# EasyEDA Pro project LEDpaideng.eprj

# Schematic Schematic1
Create Date: 2022-06-27; Project Name: LEDpaideng; Schematic Name: Schematic1; Update Date: 2022-06-27
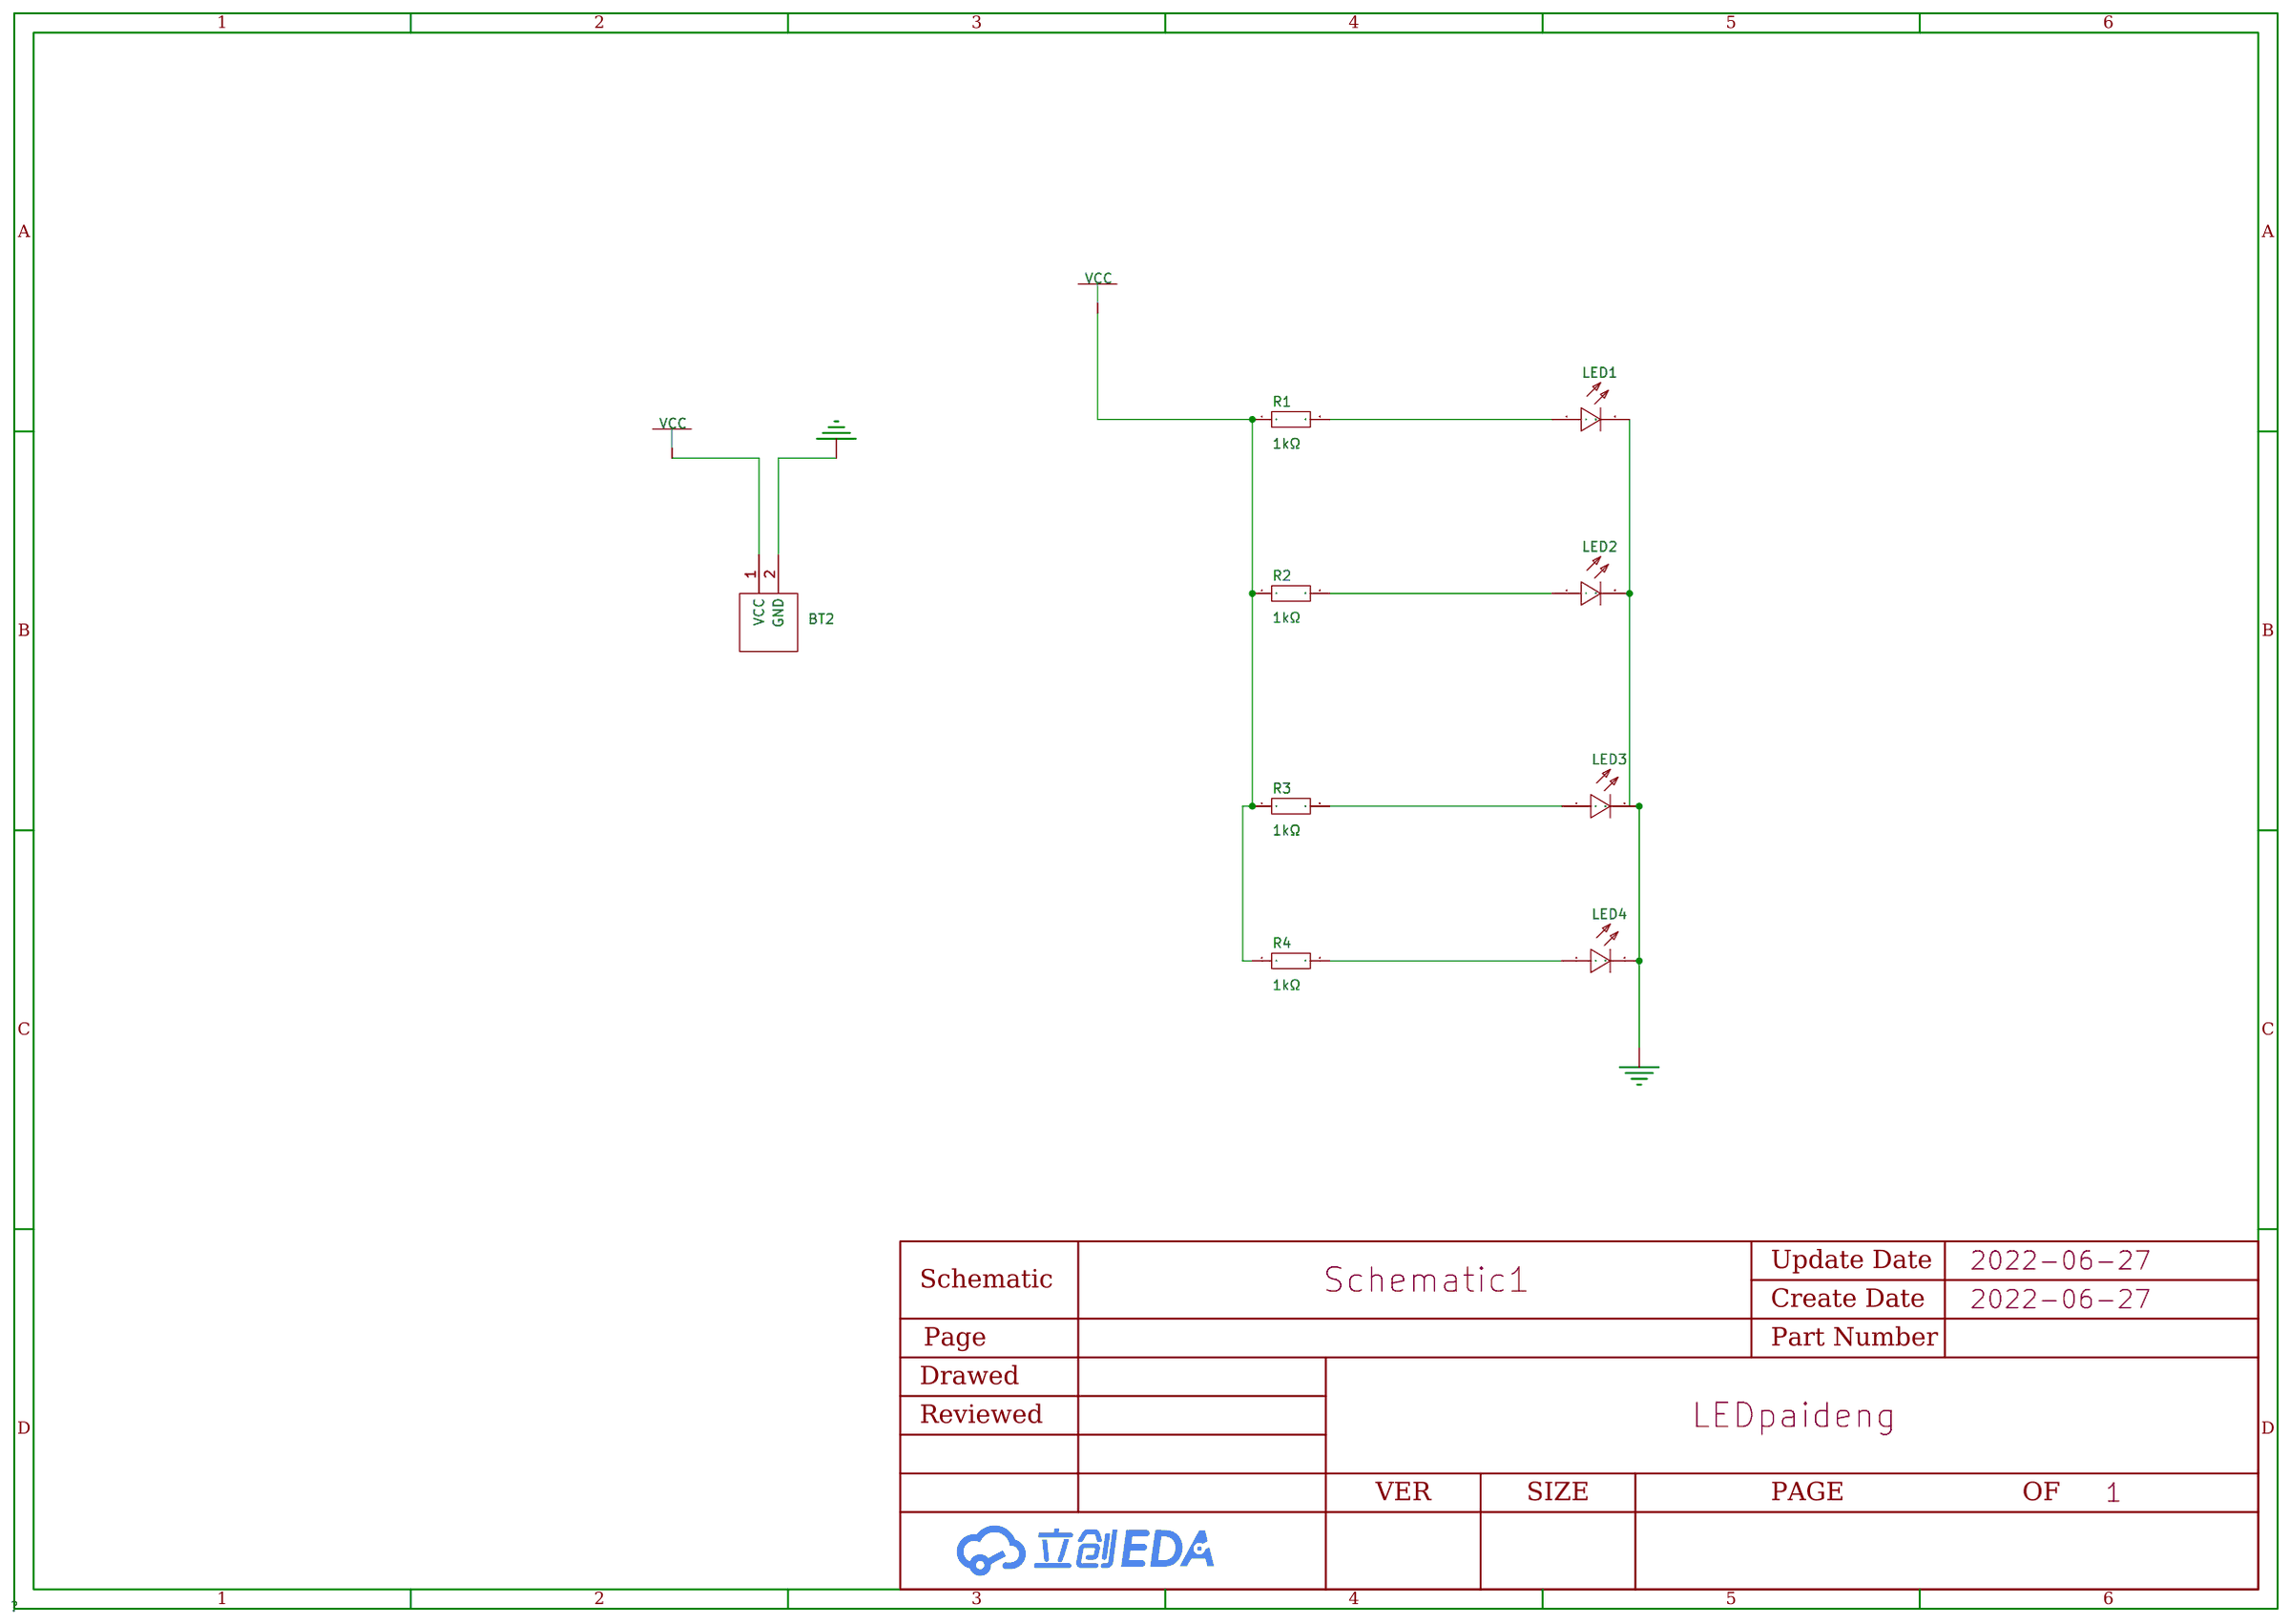
[diagram p0: schematic sheet]

## Parts
BT2  -  [C0402_NEW]
LED1  -  [LED0603-R-RD]
LED2  -  [LED0603-R-RD]
LED3  -  [LED0603-R-RD]
LED4  -  [LED0603-R-RD]
R1  1kΩ  [R0201]
R2  1kΩ  [R0201]
R3  1kΩ  [R0201]
R4  1kΩ  [R0201]

## Library data of the parts
BT2 = 五号2节并列电池盒: 连接器类型:电池盒;适用电池规格:5号;工作温度范围:-;; LCSC Part Name: 电池盒 适用电池:5号 2节并列 线长150mm; Supplier Part: C5404; Manufacturer: 国产; Datasheet: https://atta.szlcsc.com/upload/public/pdf/source/20120922/1457706536101.pdf; Supplier: LCSC; Connector Type: 电池盒; Battery Type: 5号
LED1-LED4 = 19-217/GHC-YR1S2/3T: 发光颜色:翠绿;二极管配置:-;透镜颜色:无色透明;主波长:520nm~535nm;峰值波长:518nm;色温:-;光通量(25时):-;测试电流:20mA;正向电压(VF):3.3V;发光强度:285mcd;功率:110mW;发光角度:120°;安装方式:-;工作温度:-40~+85;; LCSC Part Name: 翠绿LED; Supplier Part: C72043; Manufacturer: EVERLIGHT(台湾亿光); Supplier Footprint: 0603; JLCPCB Part Class: Basic Part; Datasheet: https://atta.szlcsc.com/upload/public/pdf/source/20160507/1462613613780.pdf; Supplier: LCSC; Emitted Color: 翠绿; Lens Color: 无色透明; Dominant Wavelength: 520nm~535nm; Peak Wavelength: 518nm; Forward Current: 20mA; Forward Voltage (VF): 3.3V; Luminous Intensity: 285mcd; Power Dissipation: 110mW; Viewing Angle: 120°; Operating Temperature: -40~+85
R1-R4 = RC-01W1002FT: 阻值:10kΩ;精度:±1%;功率:50mW;温度系数:±200ppm/;最大工作电压:25V;工作温度范围:-55~+125;; LCSC Part Name: 10kΩ ±1%; Supplier Part: C304501; Manufacturer: FH(风华); Supplier Footprint: 0201; JLCPCB Part Class: Extended Part; Datasheet: https://atta.szlcsc.com/upload/public/pdf/source/20181030/C304501_FF38550671994E5E8FB5233A4E4A9820.pdf; Supplier: LCSC; Tolerance: ±1%; Power(Watts): 50mW; Temperature Coefficient: ±200ppm/; Overload Voltage (Max): 25V; Operating Temperature Range: -55~+125

## Nets
GND: BT2.2(GND) LED1.2(C) LED2.2(C) LED3.2(C) LED4.2(C)
VCC: BT2.1(VCC) R1.1 R2.1 R3.1 R4.1
$1N1060: LED3.1(A) R3.2
$1N1066: LED4.1(A) R4.2
$1N1072: LED1.1(A) R1.2
$1N1078: LED2.1(A) R2.2

# Board PCB1
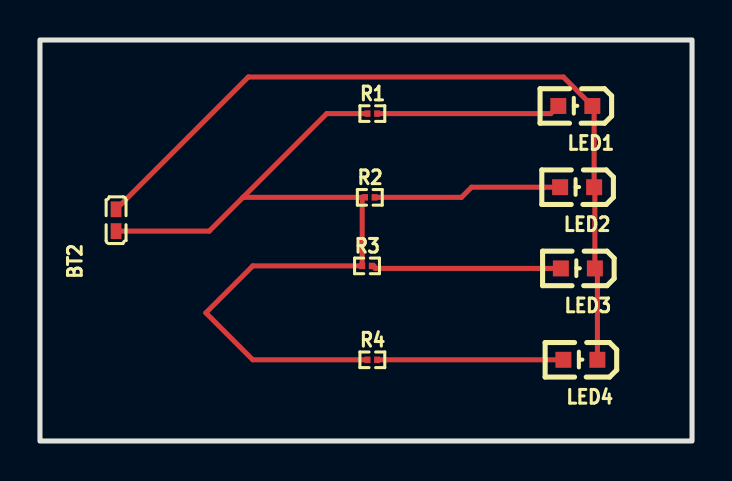
[diagram p1: board, top side]
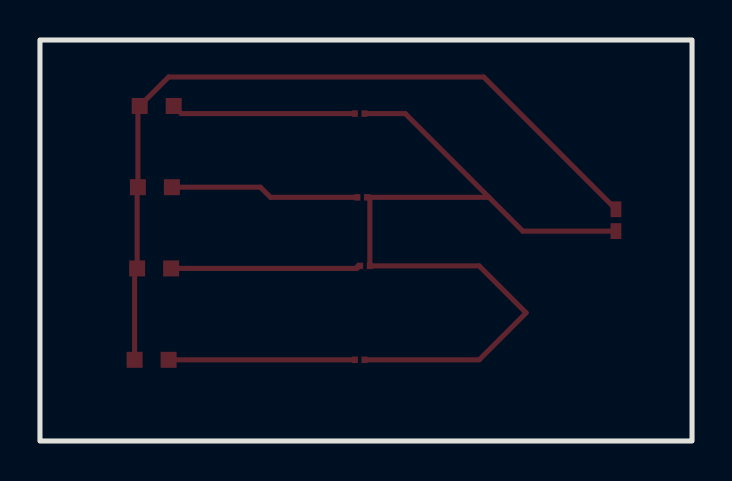
[diagram p2: board, bottom side, seen from below]

Outline 32.64 x 20.07 mm; copper layers: Top Layer, Bottom Layer. Coordinates in mm from the lower left corner of the outline.
Outline path: rectangle 0,20.07 32.64,0
Stack: Top Layer 0.035mm / Dielectric1 1.51mm FR4 er 4.5 / Bottom Layer 0.035mm

## Design rules (mm)
spacing safeClearance (default): track to track 0.152, other pairs 0.152 to 0.3
track width trackWidth (default): min 0.127, default 0.254, max 2.54
differential pair differentialPair (default): width min 0.127, default 0.254, max 2.54; gap min 0.152, default 0.152
via viaSize (default): diameter min 0.5, default 0.61, max 10; hole min 0.3, default 0.305, max 6

## Placement (name value [footprint] x y rotation side)
BT2  -  [C0402_NEW]  3.81 11.05 90 top
LED1  -  [LED0603-R-RD]  26.8 16.76 180 top
LED2  -  [LED0603-R-RD]  26.89 12.7 180 top
LED3  -  [LED0603-R-RD]  26.92 8.64 180 top
LED4  -  [LED0603-R-RD]  27.05 4.06 180 top
R1  1kΩ  [R0201]  16.64 16.38 0 top
R2  1kΩ  [R0201]  16.51 12.19 0 top
R3  1kΩ  [R0201]  16.37 8.76 0 top
R4  1kΩ  [R0201]  16.64 4.06 0 top

## Footprints (pads in the part's own frame, mm; a bottom-side part is the same pattern mirrored in y, then rotated)
C0402_NEW
  rect 0.79x0.541 smd: 1(-0.546,0) 2(0.546,0)
LED0603-R-RD
  rect 0.8x0.8 smd: 1(0.851,0) 2(-0.851,0)
R0201
  rect 0.302x0.325 smd: 1(-0.241,0) 2(0.241,0)

## Nets
As in the schematic.

## Routing (per net, layer and track width the routed paths; a pad name or vN(x,y) marks a point on that pad's centre or on a via; arc(x,y) is an arc through that point)
GND: length 40
  Top Layer w0.254: LED4.2 27.9,8.51 LED3.2 27.78,12.66 LED2.2 27.74,16.67 LED1.2 26.2,18.21 10.43,18.21 BT2.2
VCC: length 42.4
  Top Layer w0.254: R1.1 14.35,16.38 10.16,12.19 ; 16.13,12.19 R2.1 ; 16.13,12.19 R3.1 10.65,8.76 8.3,6.41 10.65,4.06 R4.1 ; 16.13,12.19 10.16,12.19 ; 10.16,12.19 8.47,10.5 3.81,10.5
$1N1060: length 9.6
  Top Layer w0.254: R3.2 16.72,8.76 16.72,8.7 16.78,8.64 LED3.1
$1N1066: length 9.3
  Top Layer w0.254: R4.2 LED4.1
$1N1072: length 9.2
  Top Layer w0.254: LED1.1 25.56,16.38 R1.2
$1N1078: length 9.5
  Top Layer w0.254: R2.2 21.1,12.19 21.61,12.7 LED2.1
